# Altium schematic sheet Standard Header.SchDoc
size Letter
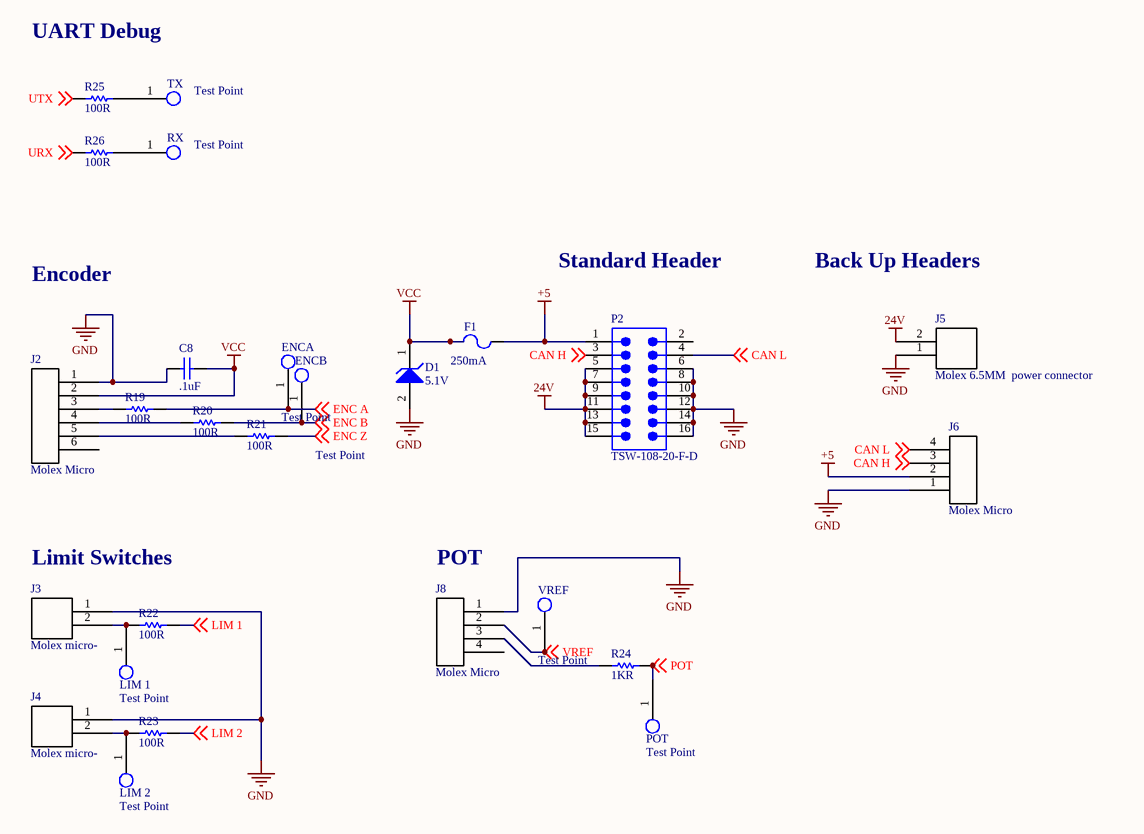
[diagram p0: Standard Header.SchDoc]

## Parts
C8  .1uF  [CAPC0805(2012)130_N]
D1  5.1V  [ONSC-SMB-2-403A-03_H_V]
ENCA  Test Point  [Test Point Through-hole]
ENCB  Test Point  [Test Point Through-hole]
F1  250mA  [BOUR-MF-NSMF150-2_V]
J2  Molex Micro  [0430450627]
J3  Molex micro-  [0430450227]
J4  Molex micro-  [0430450227]
J5  Molex 6.5MM  power connector  [1510482204]
J6  Molex Micro  [0430450427]
J8  Molex Micro  [0430450427]
LIM_1  Test Point  [Test Point Through-hole]
LIM_2  Test Point  [Test Point Through-hole]
P2  TSW-108-20-F-D  [SMTC-TSW-108-20-X-D]
POT  Test Point  [Test Point Through-hole]
R19  100R  [RESC0805(2012)_N]
R20  100R  [RESC0805(2012)_N]
R21  100R  [RESC0805(2012)_N]
R22  100R  [RESC0805(2012)_N]
R23  100R  [RESC0805(2012)_N]
R24  1KR  [RESC0805(2012)_N]
R25  100R  [RESC0805(2012)_N]
R26  100R  [RESC0805(2012)_N]
RX  Test Point  [Test Point Through-hole]
TX  Test Point  [Test Point Through-hole]
VREF  Test Point  [Test Point Through-hole]

## Nets
24V: J5.2 P2.5 P2.7 P2.9 P2.11 P2.13 P2.15
+5: F1.2 J6.2 P2.1
GND: C8.2 D1.2(A) J2.1 J3.1 J4.1 J5.1 J6.1 J8.1 P2.6 P2.8 P2.10 P2.12 P2.14 P2.16
VCC: C8.1 D1.1(K) F1.1 J2.2
CAN H: J6.3 P2.3 ; off-sheet CAN H
CAN L: J6.4 P2.4 ; off-sheet CAN L
ENC A: ENCA.1 R19.2 ; off-sheet ENC A
ENC B: ENCB.1 R20.2 ; off-sheet ENC B
ENC Z: R21.2 ; off-sheet ENC Z
LIM 1: R22.2 ; off-sheet LIM 1
LIM 2: R23.2 ; off-sheet LIM 2
POT: POT.1 R24.2 ; off-sheet POT
URX: R26.1 ; off-sheet URX
UTX: R25.1 ; off-sheet UTX
VREF: J8.2 VREF.1 ; off-sheet VREF
NetJ2_3: J2.3 R19.1
NetJ2_4: J2.4 R20.1
NetJ2_5: J2.5 R21.1
NetJ3_2: J3.2 LIM_1.1 R22.1
NetJ4_2: J4.2 LIM_2.1 R23.1
NetJ8_3: J8.3 R24.1
NetR25_2: R25.2 TX.1
NetR26_2: R26.2 RX.1

Not connected (* = marked no-connect by the designer): J2 6; J8 4; P2 2

## Notes on the sheet
- UART Debug
- Encoder
- Standard Header
- Back Up Headers
- Limit Switches
- (near J8) POT
- Title
- Size:
- Date:
- Letter
- Number:
- Time:
- Revision:
- Sheet
- of
- File:

## Library data of the parts
C8 = CMP-1036-02603-1: CAP 390pF 200V ±5% 0805 (2012 Metric) Thickness 1.3mm SMD; Case-Metric: 2012; Case-EIA: 0805; Tolerance: Â±5%; Max Thickness: 1.3 mm; Rated Voltage: 200 V; Technology: SMT; Value: 390pF
D1 = CMP-1060-00195-1: 3 W Zener Voltage Regulator, 2-Pin SMB, Pb-Free, Tape and Reel; PartNumber: 1SMB5917BT3G; Manufacturer: On Semiconductor; VZ Typ (V): 4.7; RoHS: Pb-Free; ComponentLink1Description: Manufacturer URL; ComponentLink2URL: http://www.onsemi.com/pub_link/Collateral/1SMB5913BT3-D.PDF; Mounting Technology: Surface Mount; PackageVersion: Rev. H, 05/2011; DatasheetVersion: Rev. 8; Packing: Tape and Reel; ComponentLink2Description: Datasheet; ComponentLink3Description: Package Specification; PackageReference: SMB-2-403A-03_H; ComponentLink1URL: http://www.onsemi.com/; PackageDescription: 2-Pin Small Molded Package, J-Bend Lead, Body 4.33 x 3.625 mm; ComponentLink3URL: http://www.onsemi.com/pub_link/Collateral/1SMB5913BT3-D.PDF
F1 = CMP-2000-06693-1: PTC Resettable Fuse, 6 V, 100 A, -40 to 85 degC, 2-Pin SMD, RoHS, Tape and Reel; Manufacturer: Bourns; Trip Current: 3A; Maximum Voltage DC: 6V; Current Rating: 100A; Resistance: 130mOhms; Type: PTCResettableFuses; Hold Current: 1.5A; Maximum Voltage: 6VDC; RoHS: Details; Current Rating (Max): 100A; Datasheet URL: http://www.bourns.com/docs/Product-Datasheets/mfnsmf.pdf; Package Description: 2-Pin Surface Mount Device, Body 3.2 x 1.6 mm; Series: MF-NSMF; Mounting Technology: SurfaceMount; Dimensions: 3.4mmLx1.8mmWx0.7mmH; Termination Style: SMD/SMT; Datasheet Version: Rev. T, 08/2015; Package / Case: 1206(3216metric); Manufacturer URL: http://www.bourns.com/; Product Category: ResettableFuses-PPTC; Packaging: Reel; Brand: Bourns; Mounting Style: SMD/SMT; Package Reference: MF-NSMF150-2; Current Rating - Max: 100A; Tradename: Multifuse; Factory Pack Quantity: 3000; Operating Temperature Range: -40Cto+85C
J2 = Molex micro-fit 6-pin (single row schematic): Molex micro-fit 3.0 dual row connector. P/N 0430450627
J3 J4 = Molex micro-fit 2-pin: Molex micro-fit 3.0. Molex P/N 0430450227
J6 J8 = Molex micro-fit 4-pin (Single row schematic): Molex micro-fit 3.0 dual row header. P/N 0430450427
P2 = CMP-1024-00413-1: Manufacturer: Samtec; Pitch: 2.54 mm; ComponentLink1Description: Manufacturer URL; ComponentLink1URL: http://www.samtec.com; Mounting Technology: Through-hole; PackageReference: TSW-108-20-X-D; ComponentLink3URL: http://www.samtec.com/documents/webfiles/cpdf/TSW-XXX-XX-XXX-X-XX-XXX-MKT.pdf; PackageDescription: .025[0.64] SQ. Post Terminal Strip Assembly; RoHS: True; ComponentLink2URL: http://www.samtec.com/documents/webfiles/pdf/TSW_TH.PDF; PackageVersion: DM, 8/1988; ComponentLink3Description: Package Specification; PartNumber: TSW-108-20-F-D; Temperature Range: -55 to 125 degC; DatasheetVersion: F-214; ComponentLink2Description: Datasheet; Orientation: Vertical
R19-R23 R25 R26 = 120R 5% 0805: 120R 0.125W 5% 0805 (2012 Metric)  SMD; Case-Metric: 2012; Value: 120.00 Ohm; Case-EIA: 0805; Tolerance: 5 %; Technology: SMT; Power: 0.125 W
R24 = 120R 5% 0805: Tolerance: 5 %; Case-Metric: 2012; Value: 120.00 Ohm; Case-EIA: 0805; Power: 0.125 W; Technology: SMT